# EasyEDA Pro project ProPrj_Simon_memory_game by SAAD_2026-03-01.epro

# Schematic Schematic1
Board Name: Board1; Create Date: 2026-02-08; Page Name: P1; Project Name: Simon_memory_game by SAAD; Schematic Name: Schematic1; Update Date: 2026-02-21; Company: EasyEDA.com; Page Size: A4; Version: V1.0
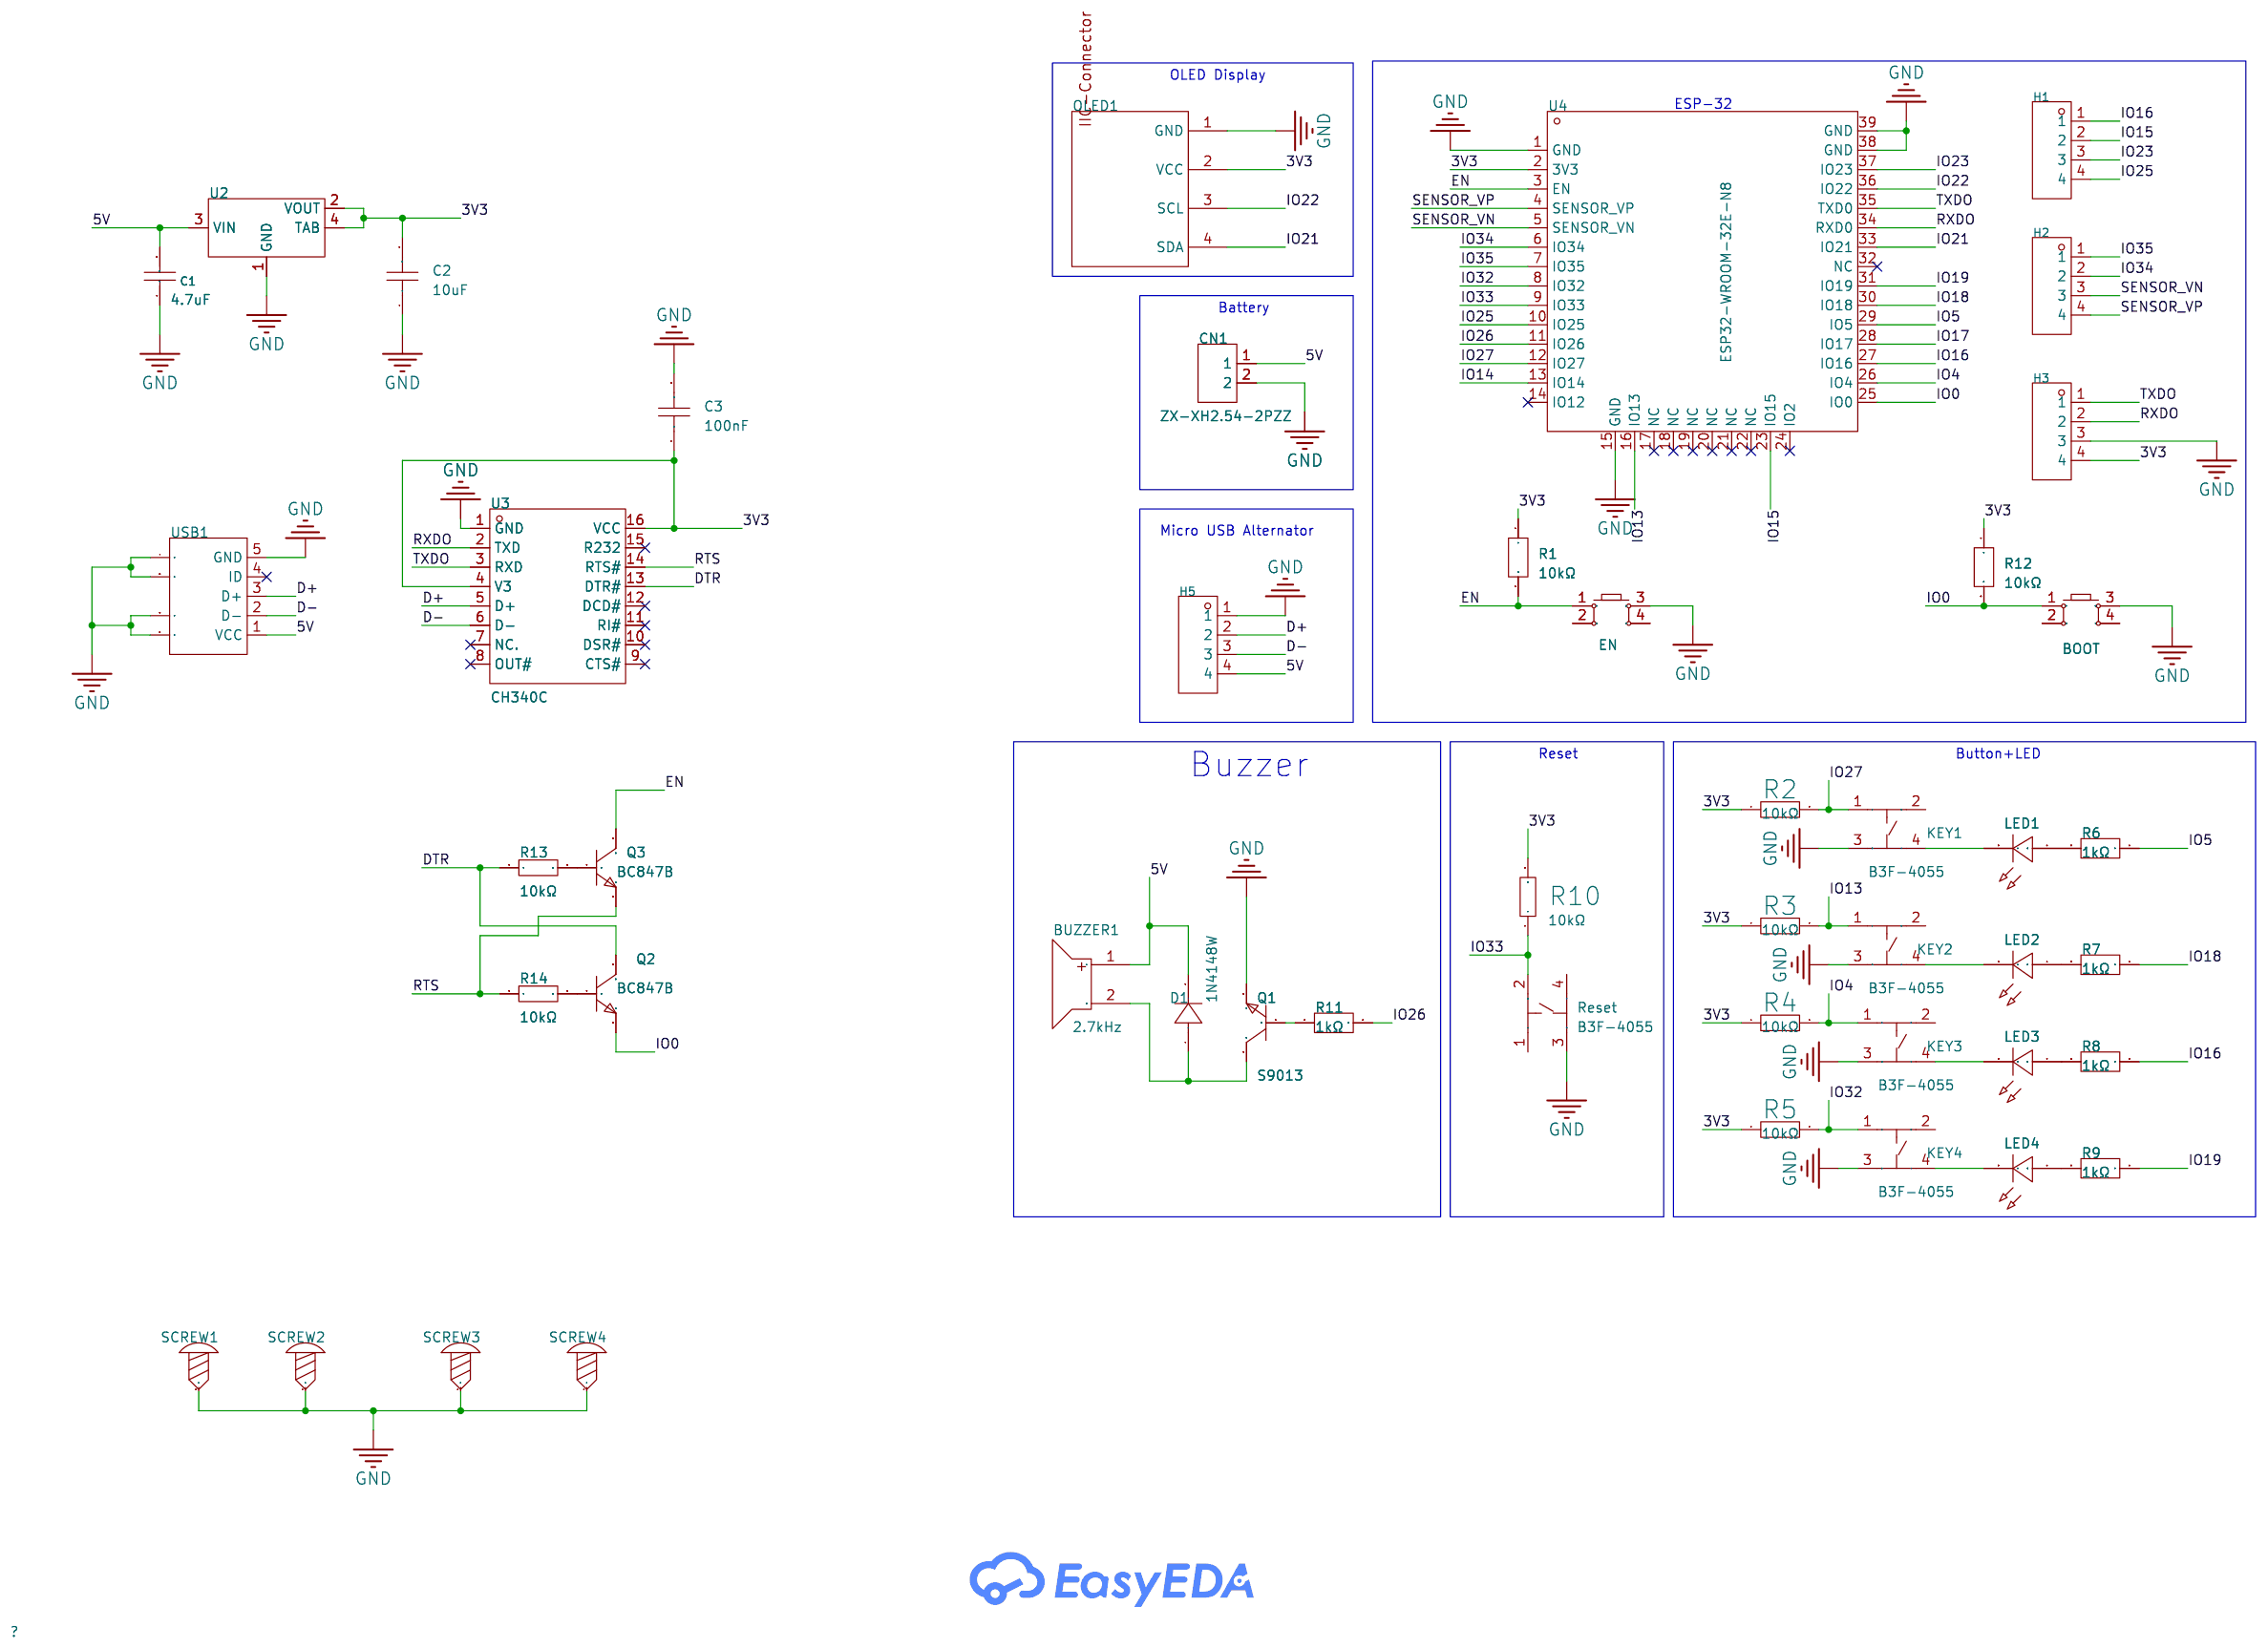
[diagram p0: schematic sheet]

## Parts
BOOT  -  [SW-SMD_4P-L6.0-W6.0-P4.50-LS9.0-2]
BUZZER1  2.7kHz  [BUZ-TH_BD9.0-P4.00-D0.6-FD]
C1  4.7uF  [C0603]
C2  10uF  [C0603]
C3  100nF  [C0603]
CN1  ZX-XH2.54-2PZZ  [CONN-TH_2P-P2.50_HX25003-2A]
D1  1N4148W  [SOD-123_L2.7-W1.6-LS3.7-FD]
EN  -  [SW-SMD_4P-L6.0-W6.0-P4.50-LS9.0-2]
H1  PZ254V-11-04P  [HDR-TH_4P-P2.54-V-M]
H2  PZ254V-11-04P  [HDR-TH_4P-P2.54-V-M]
H3  PZ254V-11-04P  [HDR-TH_4P-P2.54-V-M]
H5  PZ254V-11-04P  [HDR-TH_4P-P2.54-V-M]
KEY1  B3F-4055  [KEY-TH_4P-L12.0-W12.0-P5.00-LS13.4-EH]
KEY2  B3F-4055  [KEY-TH_4P-L12.0-W12.0-P5.00-LS13.4-EH]
KEY3  B3F-4055  [KEY-TH_4P-L12.0-W12.0-P5.00-LS13.4-EH]
KEY4  B3F-4055  [KEY-TH_4P-L12.0-W12.0-P5.00-LS13.4-EH]
LED1  -  [LED-TH_BD5.8-P2.54-FD]
LED2  -  [LED-TH_BD5.8-P2.54-FD]
LED3  -  [LED-TH_BD5.8-P2.54-FD]
LED4  -  [LED-TH_BD5.8-P2.54-FD]
OLED1  0.96OLED_4P_MODULE_JX  [0.96OLED_4P]
Q1  S9013  [SOT-23-3_L2.9-W1.3-P1.90-LS2.4-BR]
Q2  BC847B  [SOT-23-3_L2.9-W1.3-P1.90-LS2.4-BR]
Q3  BC847B  [SOT-23-3_L2.9-W1.3-P1.90-LS2.4-BR]
R1  10kΩ  [R0603]
R2  10kΩ  [R0603]
R3  10kΩ  [R0603]
R4  10kΩ  [R0603]
R5  10kΩ  [R0603]
R6  1kΩ  [R0603]
R7  1kΩ  [R0603]
R8  1kΩ  [R0603]
R9  1kΩ  [R0603]
R10  10kΩ  [R0603]
R11  1kΩ  [R0603]
R12  10kΩ  [R0603]
R13  10kΩ  [R_AXIAL-0.4]
R14  10kΩ  [R_AXIAL-0.4]
Reset  B3F-4055  [KEY-TH_4P-L12.0-W12.0-P5.00-LS13.4-EH]
SCREW1  -  [Screw-Hole-M3]
SCREW2  -  [Screw-Hole-M3]
SCREW3  -  [Screw-Hole-M3]
SCREW4  -  [Screw-Hole-M3]
U2  -  [SOT-223_L6.7-W3.5-P2.30-BR]
U3  CH340C  [SOP-16_L10.0-W3.9-P1.27-LS6.0-BL]
U4  ESP32-WROOM-32E-N8  [WIFIM-SMD_ESP32-WROOM-32-N4]
USB1  -  [MINI-USB-SMD_MINI-5PTP]

## Library data of the parts
BOOT EN = Key_SMD_6x6x6.5: Supplier Footprint: SMD
BUZZER1 = QMB-09B-03: Driver Circuitry:Passive (Externally Driven) Technology:Electromagnetic Voltage - Supply:2V~5V Voltage - Supply:2V~5V Frequency:2.7kHz Sound Pressure Level(SPL):85dB Diameter(φD):9mm Height:5.7mm; LCSC Part Name: 无源蜂鸣器QMB-09B-03; Supplier Part: C96256; Manufacturer: 华能; Supplier Footprint: 插件,D=9mm; JLCPCB Part Class: Extended Part; Datasheet: https://item.szlcsc.com/datasheet/QMB-09B-03/97460.html; Supplier: LCSC; Driver Circuitry: Passive (Externally Driven); Technology: Electromagnetic; Voltage - Supply: 2V~5V; Sound Pressure Level(SPL): 85dB; Diameter(φD): 9mm; Height: 5.7mm
C1 = CL10A475KP8NNNC: Capacitance:4.7uF Tolerance:±10% Tolerance:±10% Voltage Rating:10V Temperature Coefficient:X5R; LCSC Part Name: 4.7uF ±10% 10V; Supplier Part: C1705; Manufacturer: SAMSUNG(三星); Supplier Footprint: 0603; JLCPCB Part Class: Extended Part; Datasheet: https://item.szlcsc.com/datasheet/CL10A475KP8NNNC/2057.html; Supplier: LCSC; Tolerance: ±10%; Voltage Rating: 10V; Temperature Coefficient: X5R
C2 = CL10A106KP8NNNC: Capacitance:10uF Tolerance:±10% Tolerance:±10% Voltage Rating:10V Temperature Coefficient:X5R; LCSC Part Name: 10uF ±10% 10V; Supplier Part: C19702; Manufacturer: SAMSUNG(三星); Supplier Footprint: 0603; JLCPCB Part Class: Basic Part; Datasheet: https://item.szlcsc.com/datasheet/CL10A106KP8NNNC/20411.html; Supplier: LCSC; Tolerance: ±10%; Voltage Rating: 10V; Temperature Coefficient: X5R
C3 = CC0603KRX7R9BB104: Capacitance:100nF Tolerance:±10% Tolerance:±10% Voltage Rating:50V Temperature Coefficient:X7R; LCSC Part Name: 100nF ±10% 50V; Supplier Part: C14663; Manufacturer: YAGEO(国巨); Supplier Footprint: 0603; JLCPCB Part Class: Basic Part; Datasheet: https://item.szlcsc.com/datasheet/CC0603KRX7R9BB104/15331.html; Supplier: LCSC; Tolerance: ±10%; Voltage Rating: 50V; Temperature Coefficient: X7R
CN1 = ZX-XH2.54-2PZZ: Pins Structure:1x2P Pitch:2.5mm Mounting Type:Through Hole Reference Series:XH Number of Pins:2P Number of Rows:1 Number of PINs Per Row:2 Row Spacing:- Current Rating:2A Contact Material:Brass Contact Plating:Tin Operating Temperature:-25℃~+85℃ Operating; LCSC Part Name: 1x2P 间距:2.5mm 直插 系列:XH; Supplier Part: C7429632; Manufacturer: Megastar(兆星); Supplier Footprint: 插件,P=2.5mm; JLCPCB Part Class: Extended Part; Datasheet: https://item.szlcsc.com/datasheet/ZX-XH2.54-2PZZ/8427549.html; Supplier: LCSC; Pins Structure: 1x2P; Pitch: 2.5mm; Mounting Type: Through Hole; Reference Series: XH; Number of Pins: 2P; Number of Rows: 1; Number of PINs Per Row: 2; Current Rating: 2A; Contact Material: Brass; Contact Plating: Tin; Operating Temperature: -25℃~+85℃; Voltage Rating: 250V; Plastic Material: PA66; Flame Retardant Rating: UL94V-0; Color: White; Z-Height of the Board: 7mm; X-Length of Bottom Edge on Board (Spacing Line): 7.5mm; Y-Width of Bottom Edge on Board: 5.9mm
D1 = 1N4148W_C5345962: Diode Configuration:Independent Voltage - Forward(Vf@If):1.25V@150mA Voltage - DC Reverse(Vr):100V Current - Rectified:150mA Pd - Power Dissipation:350mW Reverse Leakage Current (Ir):1uA@75V Reverse Recovery Time (trr):4ns Operating Junction Temperature R; Supplier Part: C5345962; Manufacturer: HXY MOSFET(华轩阳电子); Supplier Footprint: SOD-123; JLCPCB Part Class: Extended Part; Datasheet: https://item.szlcsc.com/datasheet/1N4148W/6125799.html; Supplier: LCSC; Diode Configuration: Independent; Voltage - Forward(Vf@If): 1.25V@150mA; Voltage - DC Reverse(Vr): 100V; Current - Rectified: 150mA; Pd - Power Dissipation: 350mW; Reverse Leakage Current (Ir): 1uA@75V; Reverse Recovery Time (trr): 4ns; Operating Junction Temperature Range: -55℃~+150℃; Non-Repetitive Peak Forward Surge Current: 2A
H1-H3 H5 = PZ254V-11-04P: Pin Structure:1x4P Pitch:2.54mm Row Spacing:- Circluar Pins/Square Pins:Pin Header Mounting Type:Through Hole Number of Rows:1 Number of Pins:4P Current Rating:3A Voltage Rating (Max):250V Length of Mating Pin:6mm Insulation Height:2.5mm Length of End Con; LCSC Part Name: 1x4P 间距:2.54mm 方针 直插; Supplier Part: C2691448; Manufacturer: XFCN(兴飞); Supplier Footprint: 插件,P=2.54mm; JLCPCB Part Class: Extended Part; Datasheet: https://item.szlcsc.com/datasheet/PZ254V-11-04P/2801085.html; Supplier: LCSC; Pin Structure: 1x4P; Pitch: 2.54mm; Circluar Pins/Square Pins: Pin Header; Mounting Type: Through Hole; Number of Rows: 1; Number of Pins: 4P; Current Rating: 3A; Voltage Rating (Max): 250V; Length of Mating Pin: 6mm; Insulation Height: 2.5mm; Length of End Connection Pin: 3mm; Operating Temperature: -40℃~+105℃; Color: Black
KEY1-KEY4 Reset = B3F-4055_C84931: Circuit:SPST Actuator Style:Rectangular Button Mounting Type:Through Hole Length:12mm Width:12mm Switch Height:7.3mm Contact Current:50mA Voltage Rating:24V With Lamp:- Life:-; LCSC Part Name: 12*12*7.3mm 直插 轻触开关; Supplier Part: C84931; Manufacturer: OMRON(欧姆龙); Supplier Footprint: 插件; JLCPCB Part Class: Extended Part; Datasheet: https://item.szlcsc.com/datasheet/B3F-4055/86103.html; Supplier: LCSC; Circuit: SPST; Actuator Style: Rectangular Button; Mounting Type: Through Hole; Length: 12mm; Width: 12mm; Switch Height: 7.3mm; Contact Current: 50mA; Voltage Rating: 24V
LED1-LED4 = LED_TH-R_5mm: Supplier Footprint: Through
OLED1 = 0.96OLED_4P_MODULE_JX: Supplier Part: C9900004566; Supplier Footprint: 插件; JLCPCB Part Class: Extended Part; Supplier: LCSC
Q1 = S9013_C5184425: type:NPN Current - Collector(Ic):500mA Collector - Emitter Voltage VCEO:25V Pd - Power Dissipation:300mW DC Current Gain:120@50mA,1V DC Current Gain:120@50mA,1V Transition frequency(fT):150MHz Current - Collector Cutoff:100nA Vce Saturation(VCE(sat)):600m; Supplier Part: C5184425; Manufacturer: HXY MOSFET(华轩阳电子); Supplier Footprint: SOT-23; JLCPCB Part Class: Extended Part; Datasheet: https://item.szlcsc.com/datasheet/S9013/5849861.html; Supplier: LCSC; type: NPN; Current - Collector(Ic): 500mA; Collector - Emitter Voltage VCEO: 25V; Pd - Power Dissipation: 300mW; DC Current Gain: 120@50mA,1V; Transition frequency(fT): 150MHz; Current - Collector Cutoff: 100nA; Vce Saturation(VCE(sat)): 600mV
Q2 Q3 = BC847B_C20069135: type:NPN Current - Collector(Ic):100mA Collector - Emitter Voltage VCEO:45V Pd - Power Dissipation:200mW DC Current Gain:200@2.0mA,5.0V DC Current Gain:200@2.0mA,5.0V Transition frequency(fT):100MHz Current - Collector Cutoff:100nA Vce Saturation(VCE(sat); LCSC Part Name: hFE:200-450，丝印:1F NPN 电流:100mA 电压:45V; Supplier Part: C20069135; Manufacturer: R+O(宏嘉诚); Supplier Footprint: SOT-23; JLCPCB Part Class: Extended Part; Datasheet: https://item.szlcsc.com/datasheet/BC847B/21397173.html; Supplier: LCSC; type: NPN; Current - Collector(Ic): 100mA; Collector - Emitter Voltage VCEO: 45V; Pd - Power Dissipation: 200mW; DC Current Gain: 200@2.0mA,5.0V; Transition frequency(fT): 100MHz; Current - Collector Cutoff: 100nA; Vce Saturation(VCE(sat)): 500mV; Operating Temperature: -55℃~+150℃; Emitter-Base Voltage(Vebo): 6V
R1 R6-R9 R11 R12 = FRC0603F1001TS: Type:Thick Film Resistor Resistance:1kΩ Tolerance:±1% Tolerance:±1% Power(Watts):100mW Voltage-Supply(Max):75V Temperature Coefficient:±100ppm/℃ Temperature Coefficient:±100ppm/℃ Operating Temperature:-55℃~+155℃ Operating Temperature:-55℃~+155℃; LCSC Part Name: 1kΩ ±1% 100mW 厚膜电阻; Supplier Part: C2907002; Manufacturer: FOJAN(富捷); Supplier Footprint: 0603; JLCPCB Part Class: Extended Part; Supplier: LCSC; Type: Thick Film Resistor; Tolerance: ±1%; Power(Watts): 100mW; Voltage-Supply(Max): 75V; Temperature Coefficient: ±100ppm/℃; Operating Temperature: -55℃~+155℃
R2-R5 R10 = 0603WAF1002T5E: Type:Thick Film Resistor Resistance:10kΩ Tolerance:±1% Tolerance:±1% Power(Watts):100mW Voltage-Supply(Max):75V Temperature Coefficient:±100ppm/℃ Temperature Coefficient:±100ppm/℃ Operating Temperature:-55℃~+155℃ Operating Temperature:-55℃~+155℃; LCSC Part Name: 厚膜电阻 10kΩ ±1% 100mW; Supplier Part: C25804; Manufacturer: UNI-ROYAL(厚声); Supplier Footprint: 0603; JLCPCB Part Class: Basic Part; Datasheet: https://item.szlcsc.com/datasheet/0603WAF1002T5E/26547.html; Supplier: LCSC; Type: Thick Film Resistor; Tolerance: ±1%; Power(Watts): 100mW; Voltage-Supply(Max): 75V; Temperature Coefficient: ±100ppm/℃; Operating Temperature: -55℃~+155℃
R13 R14 = Res_AXIAL-1/4W: Supplier Footprint: Through
SCREW1-SCREW4 = Screw-Hole-M3: Supplier Footprint: 插件
U2 = AMS1117_1.2V: Supplier Footprint: SOT-223
U3 = CH340C: Applications Function:Transceiver USB Protocol:USB 2.0 Voltage - Supply:3.3V；5V Voltage - Supply:3.3V；5V Data Rate:2Mbps Operating Temperature:-20℃~+70℃ Operating Temperature:-20℃~+70℃ Current - Supply:7mA Supply Current (Iq):50uA; LCSC Part Name: USB转串口芯片; Supplier Part: C84681; Manufacturer: WCH(南京沁恒); Supplier Footprint: SOP-16; JLCPCB Part Class: Extended Part; Datasheet: https://item.szlcsc.com/datasheet/CH340C/85852.html; Supplier: LCSC; Applications Function: Transceiver; USB Protocol: USB 2.0; Voltage - Supply: 3.3V；5V; Data Rate: 2Mbps; Operating Temperature: -20℃~+70℃; Current - Supply: 7mA; Supply Current (Iq): 50uA
U4 = ESP32-WROOM-32E-N8: Supplier: LCSC; Supplier Part: C2973651; Manufacturer: null; Manufacturer Part: ESP32-WROOM-32E-N8-被合并; JLCPCB Part Class: Extended Part
USB1 = USB_MINI-B: Supplier Footprint: SMD

## Nets
3V3: C2.2 C3.1 H3.4 OLED1.2(VCC) R1.1 R2.1 R3.1 R4.1 R5.1 R10.2 R12.1 U2.2(VOUT) U2.4(TAB) U3.4(V3) U3.16(VCC) U4.2(3V3)
5V: BUZZER1.1 C1.2 CN1.1 D1.2(-) H5.4 U2.3(VIN) USB1.1(VCC)
GND: BOOT.3 C1.1 C2.1 C3.2 CN1.2 EN.3 H3.3 H5.1 KEY1.3 KEY2.3 KEY3.3 KEY4.3 OLED1.1(GND) Q1.2(E) Reset.3 SCREW1.1 SCREW2.1 SCREW3.1 SCREW4.1 U2.1(GND) U3.1(GND) U4.1(GND) U4.15(GND) U4.38(GND) U4.39(GND) USB1.5(GND) USB1.6(EH) USB1.7(EH) USB1.8(EH) USB1.9(EH)
D+: H5.2 U3.5(D+) USB1.3(D+)
D-: H5.3 U3.6(D-) USB1.2(D-)
DTR: Q2.3(C) R13.1 U3.13(DTR#)
EN: EN.1 Q3.3(C) R1.2 U4.3(EN)
IO0: BOOT.1 Q2.2(E) R12.2 U4.25(IO0)
IO4: KEY3.1 R4.2 U4.26(IO4)
IO5: R6.1 U4.29(IO5)
IO13: KEY2.1 R3.2 U4.16(IO13)
IO14: U4.13(IO14)
IO15: H1.2 U4.23(IO15)
IO16: H1.1 R8.1 U4.27(IO16)
IO17: U4.28(IO17)
IO18: R7.1 U4.30(IO18)
IO19: R9.1 U4.31(IO19)
IO21: OLED1.4(SDA) U4.33(IO21)
IO22: OLED1.3(SCL) U4.36(IO22)
IO23: H1.3 U4.37(IO23)
IO25: H1.4 U4.10(IO25)
IO26: R11.1 U4.11(IO26)
IO27: KEY1.1 R2.2 U4.12(IO27)
IO32: KEY4.1 R5.2 U4.8(IO32)
IO33: R10.1 Reset.2 U4.9(IO33)
IO34: H2.2 U4.6(IO34)
IO35: H2.1 U4.7(IO35)
RTS: Q3.2(E) R14.1 U3.14(RTS#)
RXDO: H3.2 U3.2(TXD) U4.34(RXD0)
SENSOR_VN: H2.3 U4.5(SENSOR_VN)
SENSOR_VP: H2.4 U4.4(SENSOR_VP)
TXDO: H3.1 U3.3(RXD) U4.35(TXD0)
$1N4177: LED1.1(C) R6.2
$1N4181: KEY1.4 LED1.2(A)
$1N4249: LED2.1(C) R7.2
$1N4314: LED3.1(C) R8.2
$1N4446: LED4.1(C) R9.2
$1N4453: KEY4.4 LED4.2(A)
$1N4457: KEY3.4 LED3.2(A)
$1N4462: KEY2.4 LED2.2(A)
$1N4873: Q1.1(B) R11.2
$1N4989: BUZZER1.2 D1.1(+) Q1.3(C)
$1N17958: Q3.1(B) R13.2
$1N17984: Q2.1(B) R14.2

Not connected (* = marked no-connect by the designer): BOOT 2 4; EN 2 4; KEY1 2; KEY2 2; KEY3 2; KEY4 2; Reset 1 4; U3 7(NC.)* 8(OUT#)* 9(CTS#)* 10(DSR#)* 11(RI#)* 12(DCD#)* 15(R232)*; U4 14(IO12)* 17(NC)* 18(NC)* 19(NC)* 20(NC)* 21(NC)* 22(NC)* 24(IO2)* 32(NC)*; USB1 4(ID)*

## Notes on the sheet
- OLED Display
- ESP-32
- Battery
- Micro USB Alternator
- Reset
- Button+LED
- Buzzer

# Board PCB1
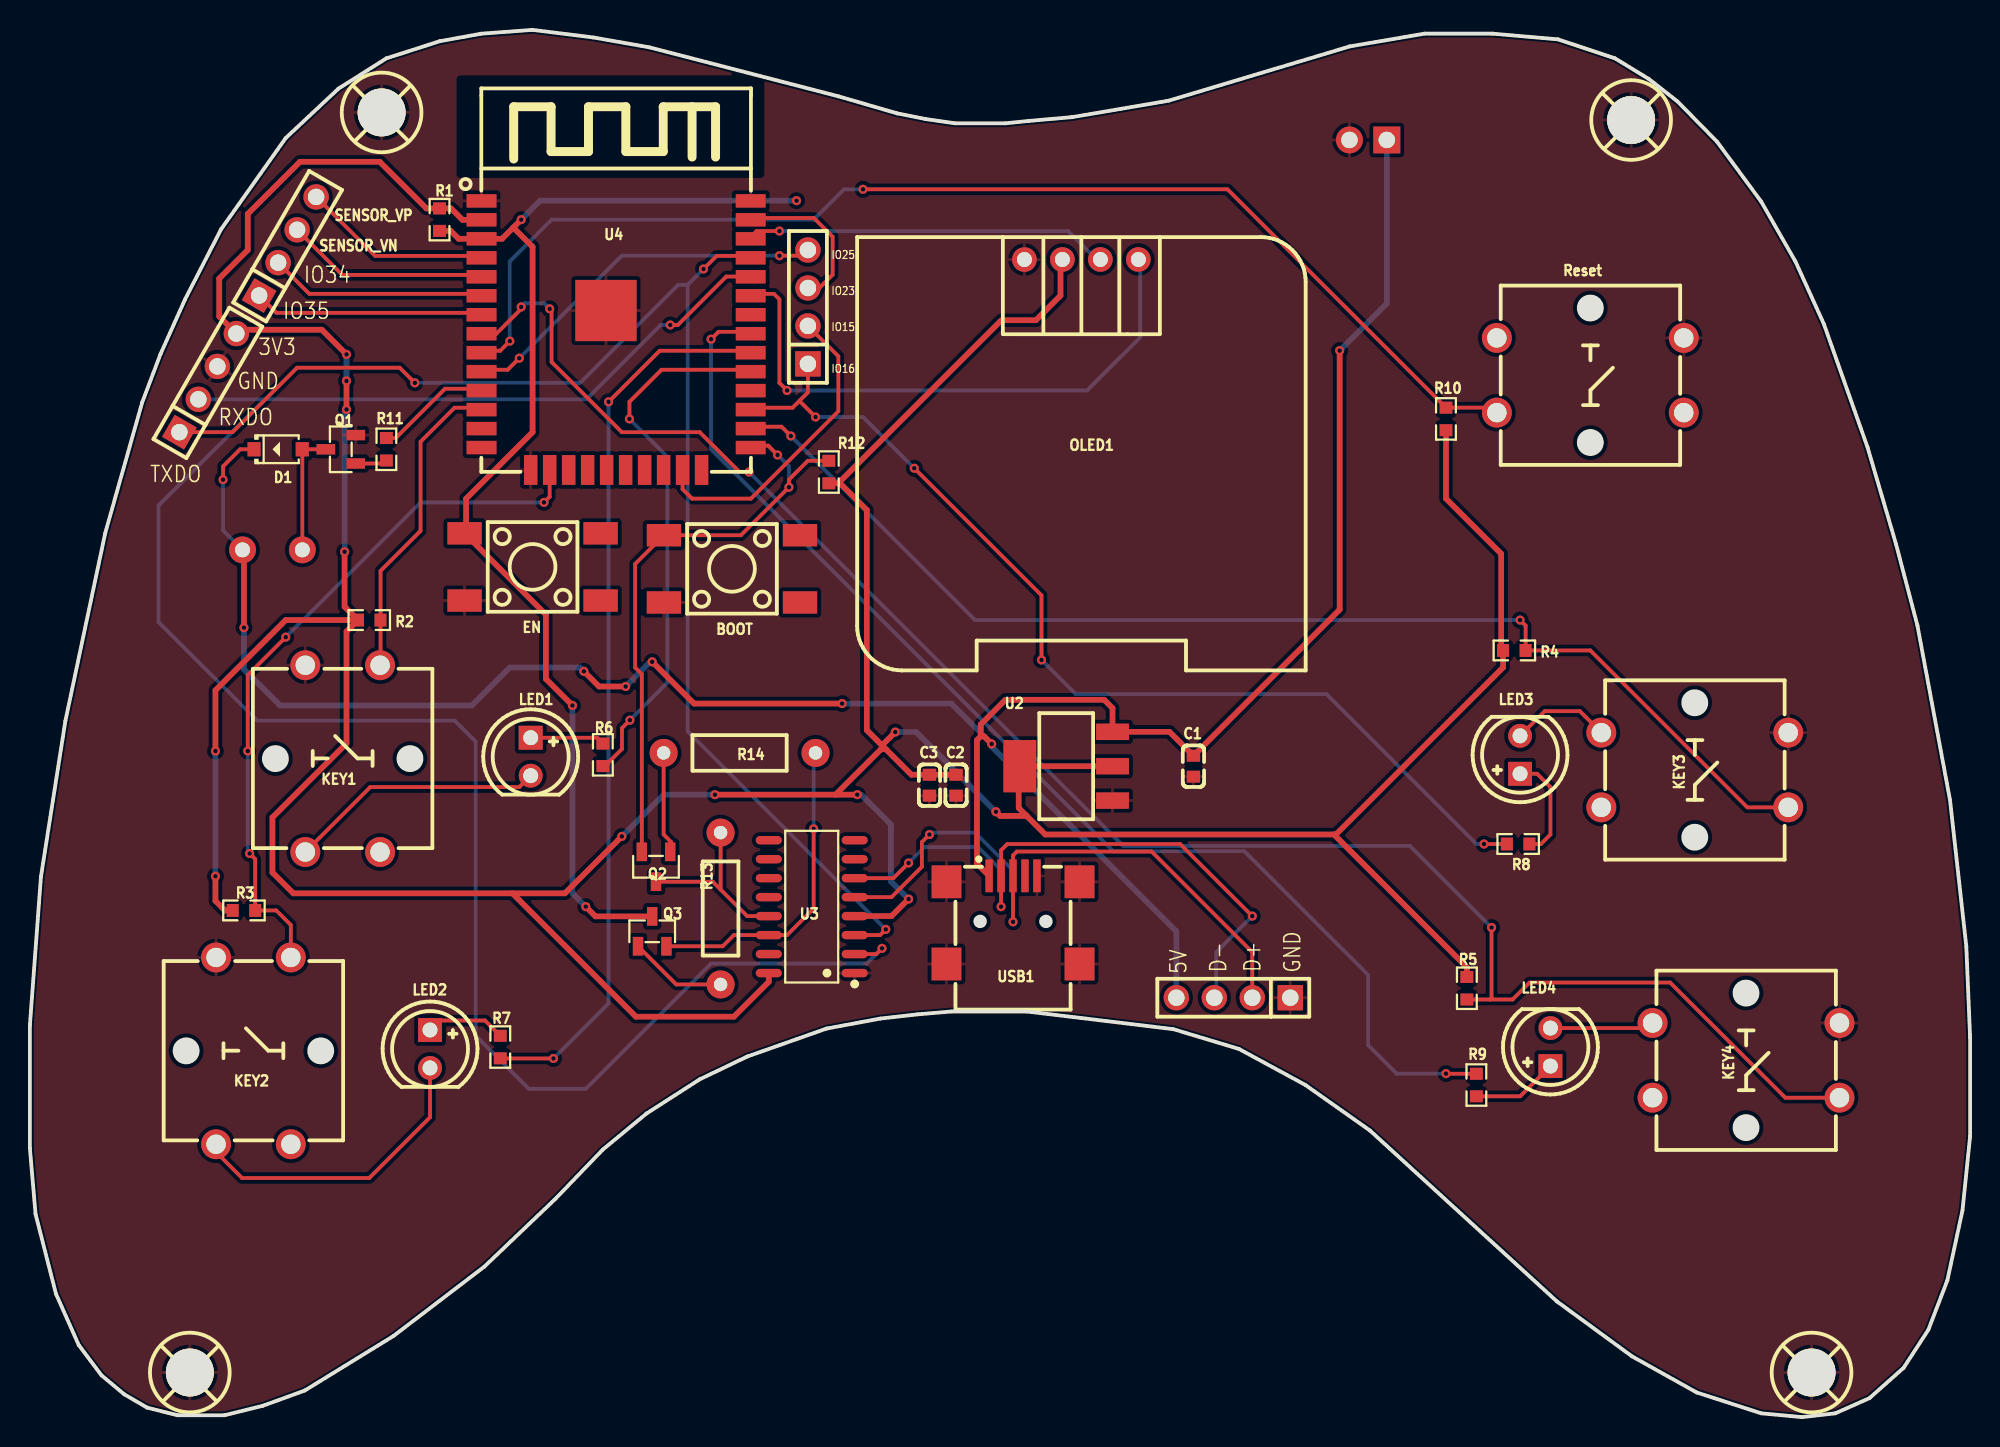
[diagram p1: board, top side]
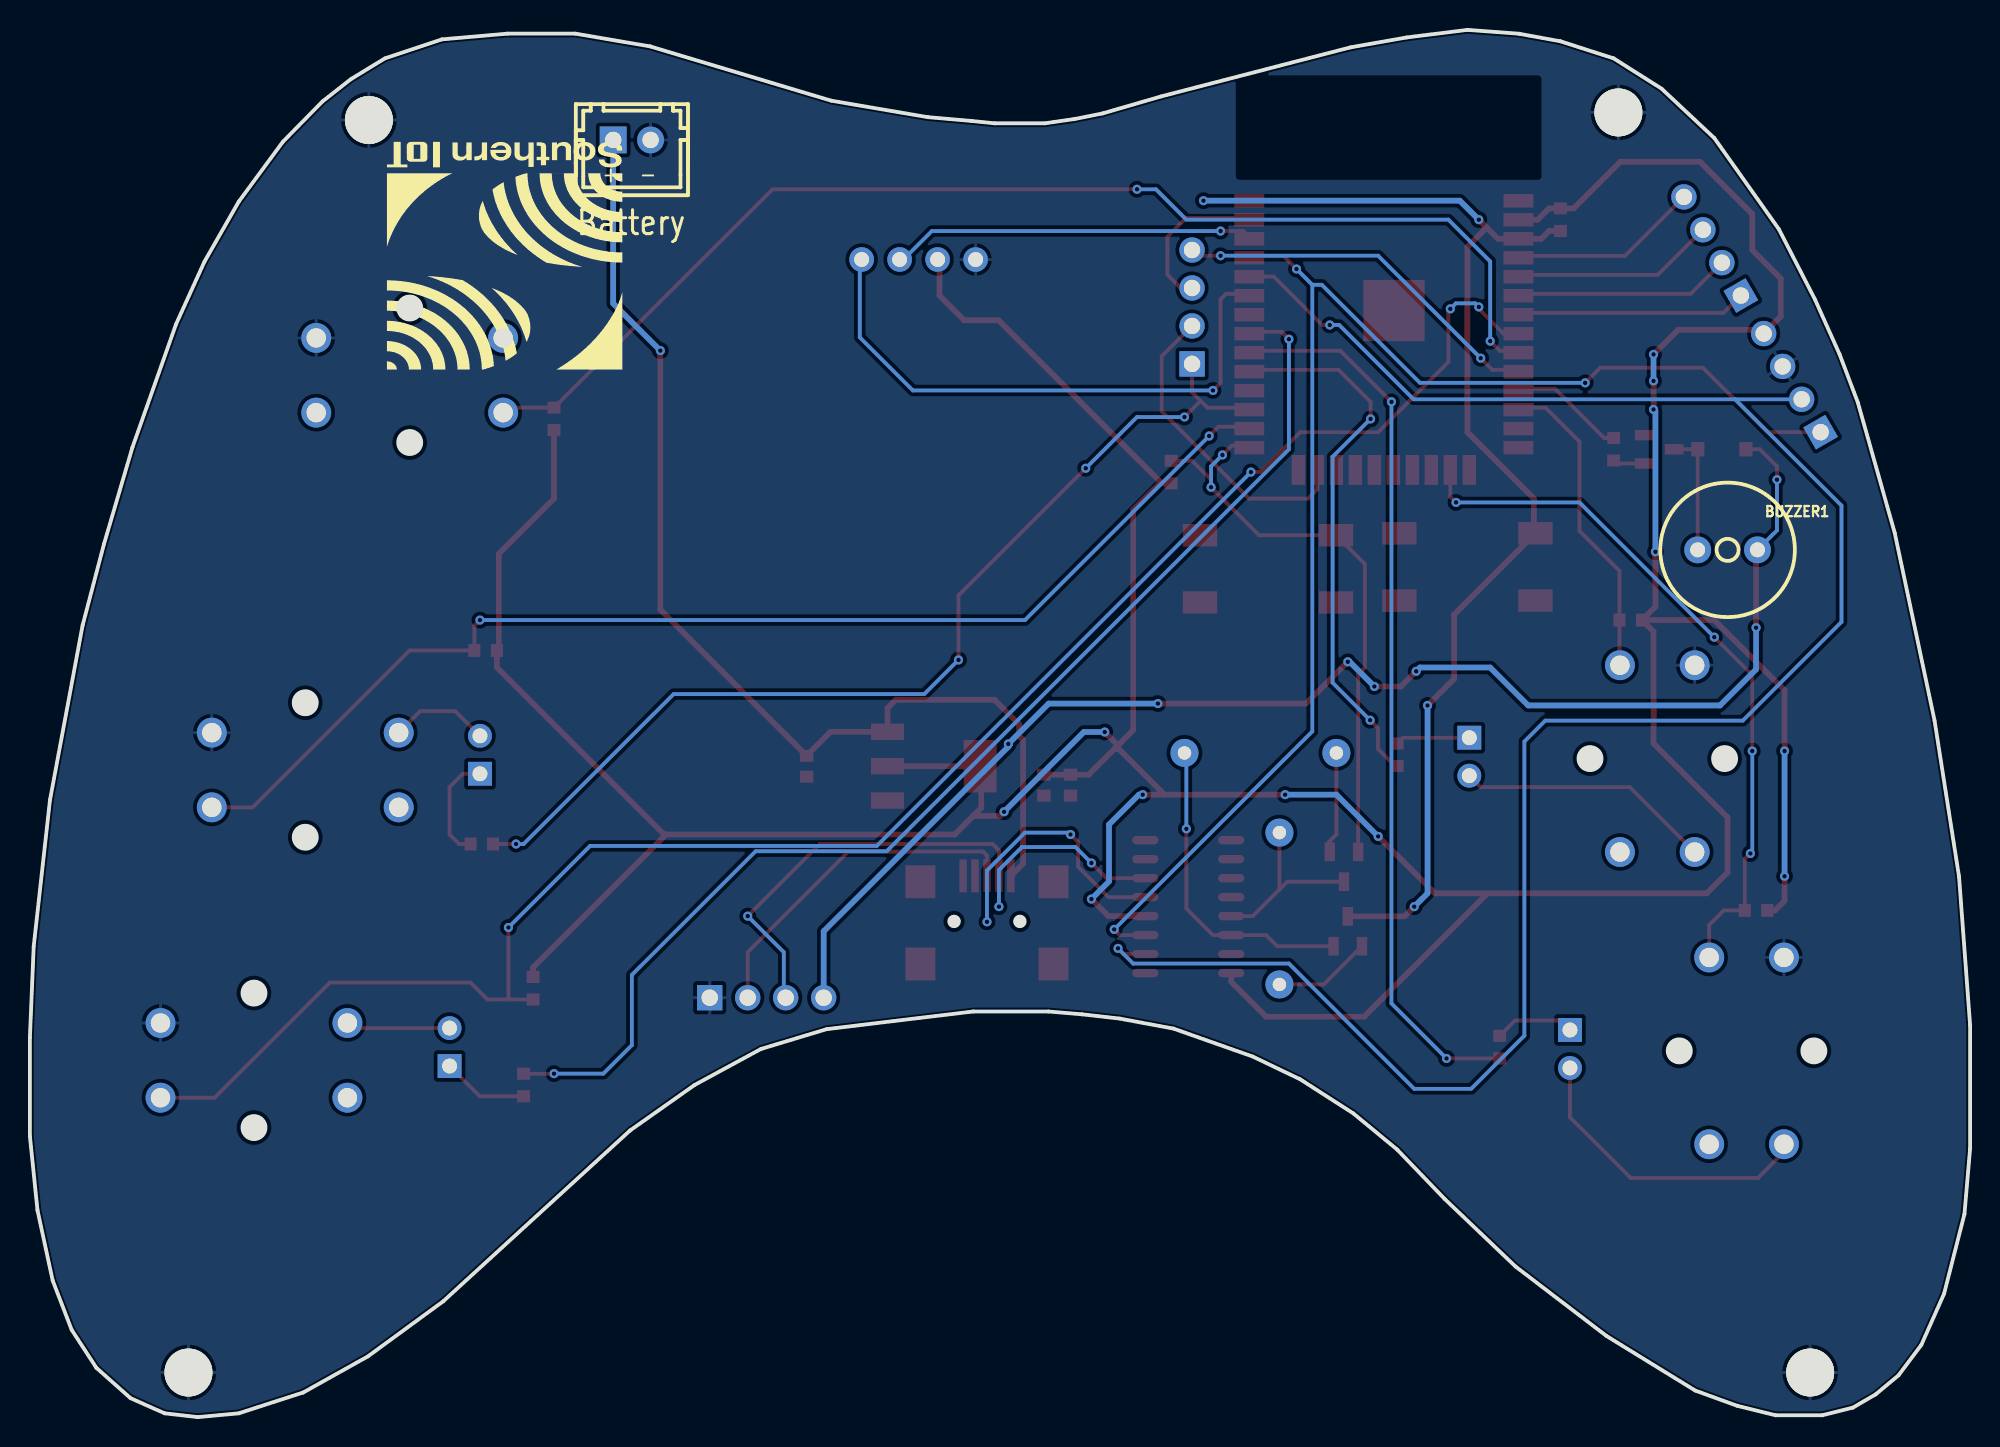
[diagram p2: board, bottom side, seen from below]

Outline 129.76 x 92.84 mm; copper layers: Top Layer, Bottom Layer. Coordinates in mm from the lower left corner of the outline.
Outline path: 0,26.24 0.74,36.16 2.38,46.61 5.04,59.18 7.51,67.9 8.73,71.12 10.38,74.8 12.79,79.5 17.11,85.6 20.64,88.91 23.84,90.93 27.4,92.08 30.19,92.58 33.62,92.84 37.68,92.33 41.42,91.67 54.07,88.39 58,87.25 59.91,86.87 61.88,86.58 65.24,86.58 66.77,86.74 69.69,87 76.16,88.1 88.28,91.73 93.28,92.59 97.8,92.59 102.2,92.2 106.01,90.93 108.29,89.54 110.18,88.05 112.83,85.35 115.79,81.34 118.07,77.34 119.98,73.15 122.9,64.9 124.8,58.42 126.23,52.98 128.42,41.29 129.5,31.5 129.76,25.4 129.76,18.8 129.25,13.84 128.23,9.14 126.96,5.84 125.31,3.3 123.03,1.27 120.74,0.25 118.53,0 115.79,0.25 111.47,1.65 107.15,4.06 102.12,7.74 89.63,19.18 85.31,22.22 80.86,24.64 76.47,25.96 66.66,27.15 61.65,27.15 59.37,26.95 56.86,26.67 53.27,26 47.97,24.13 44.79,22.61 41.24,20.32 38.32,17.91 35.14,14.61 30.4,10.08 24.32,5.43 18.38,1.78 15.58,0.76 13.02,0.13 9.87,0.13 7.84,0.64 6.31,1.52 4.79,2.79 3.27,4.83 1.74,8.25 0.38,13.59 0,17.97 0,26.24
Stack: Top Layer 0.035mm / Dielectric1 1.51mm FR4 er 4.5 / Bottom Layer 0.035mm

## Design rules (mm)
template: JLCPCB Capability(Two Layers Board)
spacing copperThickness1oz (default): track to track 0.102, other pairs 0.152 to 0.3
spacing copperThickness2oz: track to track 0.203, other pairs 0.152 to 0.3
track width copperThickness1oz (default): min 0.127, default 0.254, max 2.54
track width copperThickness2oz: min 0.203, default 0.254, max 2.54
differential pair differentialPair (default): width min 0.127, default 0.254, max 2.54; gap min 0.152, default 0.152
via viaSize (default): diameter min 0.5, default 0.61, max 10; hole min 0.3, default 0.305, max 6.3

## Placement (name value [footprint] x y rotation side)
BOOT  -  [SW-SMD_4P-L6.0-W6.0-P4.50-LS9.0-2]  46.95 56.77 0 top
BUZZER1  2.7kHz  [BUZ-TH_BD9.0-P4.00-D0.6-FD]  16.22 58.04 0 bottom
C1  4.7uF  [C0603]  77.81 43.56 90 top
C2  10uF  [C0603]  61.94 42.29 90 top
C3  100nF  [C0603]  60.16 42.29 270 top
CN1  ZX-XH2.54-2PZZ  [CONN-TH_2P-P2.50_HX25003-2A]  89.5 85.47 180 bottom
D1  1N4148W  [SOD-123_L2.7-W1.6-LS3.7-FD]  16.6 64.77 180 top
EN  -  [SW-SMD_4P-L6.0-W6.0-P4.50-LS9.0-2]  33.62 56.9 0 top
H1  PZ254V-11-04P  [HDR-TH_4P-P2.54-V-M]  52.03 74.3 90 top
H2  PZ254V-11-04P  [HDR-TH_4P-P2.54-V-M]  17.24 78.36 60 top
H3  PZ254V-11-04P  [HDR-TH_4P-P2.54-V-M]  11.9 69.22 60 top
H5  PZ254V-11-04P  [HDR-TH_4P-P2.54-V-M]  80.48 28.07 180 top
KEY1  B3F-4055  [KEY-TH_4P-L12.0-W12.0-P5.00-LS13.4-EH]  20.92 44.07 90 top
KEY2  B3F-4055  [KEY-TH_4P-L12.0-W12.0-P5.00-LS13.4-EH]  14.95 24.51 90 top
KEY3  B3F-4055  [KEY-TH_4P-L12.0-W12.0-P5.00-LS13.4-EH]  111.34 43.31 0 top
KEY4  B3F-4055  [KEY-TH_4P-L12.0-W12.0-P5.00-LS13.4-EH]  114.77 23.88 0 top
LED1  -  [LED-TH_BD5.8-P2.54-FD]  33.49 44.2 270 top
LED2  -  [LED-TH_BD5.8-P2.54-FD]  26.76 24.64 270 top
LED3  -  [LED-TH_BD5.8-P2.54-FD]  99.66 44.32 90 top
LED4  -  [LED-TH_BD5.8-P2.54-FD]  101.69 24.77 90 top
OLED1  0.96OLED_4P_MODULE_JX  [0.96OLED_4P]  70.32 77.47 0 top
Q1  S9013  [SOT-23-3_L2.9-W1.3-P1.90-LS2.4-BR]  20.79 64.77 0 top
Q2  BC847B  [SOT-23-3_L2.9-W1.3-P1.90-LS2.4-BR]  41.87 36.83 90 top
Q3  BC847B  [SOT-23-3_L2.9-W1.3-P1.90-LS2.4-BR]  41.62 32.51 270 top
R1  10kΩ  [R0603]  27.4 80.14 270 top
R2  10kΩ  [R0603]  22.7 53.34 0 top
R3  10kΩ  [R0603]  14.31 33.91 0 top
R4  10kΩ  [R0603]  99.28 51.31 0 top
R5  10kΩ  [R0603]  96.1 28.7 270 top
R6  1kΩ  [R0603]  38.32 44.32 90 top
R7  1kΩ  [R0603]  31.46 24.77 90 top
R8  1kΩ  [R0603]  99.53 38.35 0 top
R9  1kΩ  [R0603]  96.74 22.22 270 top
R10  10kΩ  [R0603]  94.71 66.8 270 top
R11  1kΩ  [R0603]  23.84 64.77 270 top
R12  10kΩ  [R0603]  53.43 63.25 90 top
R13  10kΩ  [R_AXIAL-0.4]  46.19 34.04 270 top
R14  10kΩ  [R_AXIAL-0.4]  47.46 44.45 180 top
Reset  B3F-4055  [KEY-TH_4P-L12.0-W12.0-P5.00-LS13.4-EH]  104.36 69.72 0 top
SCREW1  -  [Screw-Hole-M3]  10.76 2.92 0 top
SCREW2  -  [Screw-Hole-M3]  23.59 87.25 0 top
SCREW3  -  [Screw-Hole-M3]  107.15 86.74 0 top
SCREW4  -  [Screw-Hole-M3]  119.22 2.92 0 top
U2  -  [SOT-223_L6.7-W3.5-P2.30-BR]  69.31 43.56 0 top
U3  CH340C  [SOP-16_L10.0-W3.9-P1.27-LS6.0-BL]  52.29 34.16 90 top
U4  ESP32-WROOM-32E-N8  [WIFIM-SMD_ESP32-WROOM-32-N4]  39.21 72.39 0 top
USB1  -  [MINI-USB-SMD_MINI-5PTP]  65.75 33.27 0 top

## Footprints (pads in the part's own frame, mm; a bottom-side part is the same pattern mirrored in y, then rotated)
0.96OLED_4P
  round 1.65 hole 1: 1(-3.81,-0.002) 2(-1.27,0.002) 3(1.27,0.002) 4(3.81,0.002)
BUZ-TH_BD9.0-P4.00-D0.6-FD
  round 1.8 hole 1: 1(-2,0) 2(2,0)
C0603
  rect 0.8x0.9 smd: 1(-0.7,0) 2(0.7,0)
CONN-TH_2P-P2.50_HX25003-2A
  rect 1.8x1.8 hole 1.1: 1(-1.25,0)
  round 1.8 hole 1.1: 2(1.25,0)
HDR-TH_4P-P2.54-V-M
  rect 1.7x1.7 hole 1.1: 1(-3.81,0)
  round 1.7 hole 1.1: 2(-1.27,0) 3(1.27,0) 4(3.81,0)
KEY-TH_4P-L12.0-W12.0-P5.00-LS13.4-EH
  round 2 hole 1.3: 1(6.25,-2.5) 2(-6.25,-2.5) 3(6.25,2.5) 4(-6.25,2.5)
LED-TH_BD5.8-P2.54-FD
  rect 1.6x1.6 hole 1: 1(-1.27,0)
  round 1.6 hole 1: 2(1.27,0)
MINI-USB-SMD_MINI-5PTP
  rect 0.5x2.2 smd: 1(-1.6,2.95) 2(-0.8,2.95) 3(0,2.95) 4(0.8,2.95) 5(1.6,2.95)
  rect 2x2.2 smd: 6(-4.45,2.55) 7(4.45,2.55) 8(4.45,-2.95) 9(-4.45,-2.95)
R0603
  rect 0.806x0.864 smd: 1(-0.753,0) 2(0.753,0)
R_AXIAL-0.4
  round 1.879 hole 0.899: 1(-5.08,0) 2(5.08,0)
Screw-Hole-M3
  round 3.2 hole 3.2: 1(-0.064,0.064)
SOD-123_L2.7-W1.6-LS3.7-FD
  rect 0.88x0.96 smd: 1(-1.61,0) 2(1.61,0)
SOP-16_L10.0-W3.9-P1.27-LS6.0-BL
  oval 0.56x1.745 smd: 1(-4.445,-2.873) 2(-3.175,-2.873) 3(-1.905,-2.873) 4(-0.635,-2.873) 5(0.635,-2.873) 6(1.905,-2.873) 7(3.175,-2.873) 8(4.445,-2.873) 9(4.445,2.873) 10(3.175,2.873) 11(1.905,2.873) 12(0.635,2.873) 13(-0.635,2.873) 14(-1.905,2.873) 15(-3.175,2.873) 16(-4.445,2.873)
SOT-23-3_L2.9-W1.3-P1.90-LS2.4-BR
  rect 1.25x0.7 smd: 1(1,-0.95) 2(1,0.95) 3(-1,0)
SOT-223_L6.7-W3.5-P2.30-BR
  rect 2.2x1.1 smd: 1(3.099,-2.3) 2(3.099,0) 3(3.099,2.3)
  rect 2.2x3.5 smd: 4(-3.099,0)
SW-SMD_4P-L6.0-W6.0-P4.50-LS9.0-2
  rect 2.3x1.5 smd: 1(-4.55,2.25) 2(4.55,2.25) 3(-4.55,-2.25) 4(4.55,-2.25)
WIFIM-SMD_ESP32-WROOM-32-N4
  rect 2x0.9 smd: 1(-9,9.005) 2(-9,7.735) 3(-9,6.465) 4(-9,5.195) 5(-9,3.925) 6(-9,2.655) 7(-9,1.385) 8(-9,0.115) 9(-9,-1.155) 10(-9,-2.425) 11(-9,-3.695) 12(-9,-4.965) 13(-9,-6.235) 14(-9,-7.505) 25(9,-7.505) 26(9,-6.235) 27(9,-4.965) 28(9,-3.695) 29(9,-2.425) 30(9,-1.155) 31(9,0.115) 32(9,1.385) 33(9,2.655) 34(9,3.925) 35(9,5.195) 36(9,6.465) 37(9,7.735) 38(9,9.005)
  rect 0.9x2 smd: 15(-5.715,-9.005) 16(-4.445,-9.005) 17(-3.175,-9.005) 18(-1.905,-9.005) 19(-0.635,-9.005) 20(0.635,-9.005) 21(1.905,-9.005) 22(3.175,-9.005) 23(4.445,-9.005) 24(5.715,-9.005)
  rect 4.1x4.1 smd: 39(-0.68,1.665)

## Nets
As in the schematic.

Pads without a net: BOOT 2 4; EN 2 4; KEY1 2; KEY2 2; KEY3 2; KEY4 2; Reset 1 4; U3 7 8 9 10 11 12 15; U4 14 17 18 19 20 21 22 24 32; USB1 4

## Via types
v1: diameter 0.61, hole 0.305, Top Layer to Bottom Layer, 63 vias

## Routing (per net, layer and track width the routed paths; a pad name or vN(x,y) marks a point on that pad's centre or on a via; arc(x,y) is an arc through that point)
3V3: length 319.6
  Top Layer w0.381: v1(12.41,44.58) 12.41,48.64 17.11,53.34 R2.1 ; 56.89,45.06 55.97,45.97 55.97,60.71 54.18,62.49 ; 56.89,45.06 57.25,44.7 ; 56.89,45.06 57.09,45.06 v1(57.88,45.85) ; v1(39.59,38.86) 35.78,35.05 32.27,35.05 ; 54.18,62.49 54.18,62.62 64.91,73.35 ; 54.18,62.49 R12.1 ; 53.88,41.66 56.92,44.7 57.25,44.7 ; 53.88,41.66 v1(55.34,41.66) ; 53.88,41.66 v1(45.81,41.66) ; 32.27,35.05 17.62,35.05 16.22,36.45 16.22,40.13 21.17,45.09 21.17,52.57 R2.1 ; 32.27,35.05 40.53,26.8 47.08,26.8 49.41,29.13 U3.16 ; 57.25,44.7 58.95,42.99 C3.1 C2.2 ; 87.21,38.99 87.34,38.99 98.52,50.17 R4.1 98.4,51.44 98.4,57.78 94.71,61.47 R10.2 ; 87.21,38.99 96.1,30.1 R5.1 ; 87.21,38.99 67.91,38.99 66.66,40.23 ; v1(21.05,57.91) 21.05,54.24 R2.1 ; v1(21.17,69.34) v1(21.17,67.44) ; U2.2 U2.4 66.13,43.48 66.13,40.77 66.66,40.23 ; v1(64.61,40.51) 64.89,40.23 66.66,40.23 ; R3.1 13.04,33.91 12.41,34.54 v1(12.41,36.2) ; U4.2 28.93,80.12 28.17,80.89 R1.1 26.52,80.89 23.39,84.01 18.06,84.01 14.57,80.52 14.57,78.11 12.66,76.2 12.66,73.66 H3.4 14.06,72.77 19.52,72.77 v1(21.17,71.12) ; v1(58.76,34.67) 57.62,33.53 U3.4 ; 69.05,77.22 68.92,77.09 68.92,75.06 67.27,73.41 64.99,73.41
  Bottom Layer w0.381: v1(57.88,45.85) 59.27,45.85 v1(64.61,40.51) ; v1(55.34,41.66) 55.59,41.66 57.59,39.66 57.59,35.85 v1(58.76,34.67) ; v1(12.41,44.58) v1(12.41,36.2) ; v1(21.17,71.12) v1(21.17,69.34) ; v1(21.17,67.44) 21.05,67.31 v1(21.05,57.91) ; v1(39.59,38.86) 42.38,41.66 v1(45.81,41.66)
5V: length 169.8
  Top Layer w0.254: D1.2 14.06,64.77 12.92,63.63 v1(12.92,62.74)
  Top Layer w0.381: 64.15,36.22 63.34,37.04 63.34,45.31 63.59,45.56 ; BUZZER1.1 14.31,57.94 v1(14.31,52.83) ; v1(87.59,71.37) 87.59,54.04 C1.2 76.21,45.86 U2.3 72.4,47.45 71.85,48.01 65.24,48.01 63.59,46.36 63.59,45.56 ; 63.59,45.56 63.81,45.56 v1(64.32,45.05) ; v1(39.84,48.9) 38.06,48.9 v1(37.05,49.91) ; v1(41.62,50.55) 44.41,47.75 v1(54.32,47.75)
  Bottom Layer w0.254: v1(12.92,62.74) 12.92,59.34 BUZZER1.1
  Bottom Layer w0.381: v1(87.59,71.37) 90.75,74.53 CN1.1 ; v1(39.84,48.9) 41.49,50.55 v1(41.62,50.55) ; v1(37.05,49.91) 36.79,50.17 32.09,50.17 29.55,47.62 16.73,47.62 14.31,50.04 v1(14.31,52.83) ; H5.4 76.67,32.51 64.32,44.86 v1(64.32,45.05) 61.62,47.75 v1(54.32,47.75)
D+: length 44.2
  Top Layer w0.254: v1(60.16,38.99) 59.65,38.48 59.65,36.83 57.62,34.8 U3.5 ; v1(65.75,33.15) USB1.3 65.75,37.59 66,37.85 75.02,37.85 81.75,31.12 H5.2
  Bottom Layer w0.254: v1(65.75,33.15) 65.75,36.58 63.21,39.12 60.29,39.12 v1(60.16,38.99)
D-: length 43
  Top Layer w0.254: v1(81.75,33.53) 76.93,38.35 65.37,38.35 64.95,37.94 USB1.2 v1(64.95,34.16) ; v1(58.76,37.08) 57.75,36.07 U3.6
  Bottom Layer w0.254: H5.3 79.34,28.19 79.34,31.12 v1(81.75,33.53) ; v1(64.95,34.16) 64.95,36.61 63.41,38.15 59.83,38.15 v1(58.76,37.08)
DTR: length 12.3
  Top Layer w0.254: 46.19,35.31 45.67,35.83 Q2.3 ; 46.19,35.31 47.97,33.53 U3.13 ; 46.19,35.31 R13.1
EN: length 81.1
  Top Layer w0.381: 32.33,79.61 33.62,78.32 33.62,65.91 29.17,61.47 29.17,59.25 EN.1 34.51,53.71 34.51,49.4 v1(36.29,47.62) ; 32.33,79.61 31.57,78.86 U4.3 28.68,78.86 28.15,79.38 R1.2 ; 32.33,79.61 v1(32.86,80.14) ; Q3.3 37.83,33.51 v1(37.17,34.16)
  Bottom Layer w0.381: v1(32.86,80.14) 34.13,81.41 v1(51.27,81.41) ; v1(36.29,47.62) 36.29,35.05 v1(37.17,34.16)
IO0: length 40.1
  Top Layer w0.254: R12.2 52.03,64 50.76,62.74 v1(50.76,62.23) 47.55,59.02 BOOT.1 40.48,57.09 40.48,50.17 40.92,49.72 40.92,37.83 ; 48.21,65.01 49.38,65.01 v1(50,64.39)
  Bottom Layer w0.254: v1(50.76,62.23) 50.76,63.63 v1(50,64.39)
IO4: length 80.9
  Top Layer w0.254: v1(50.89,65.66) 50.27,66.28 48.21,66.28 ; v1(99.66,53.34) 100.03,52.97 R4.2 104.36,51.31 114.86,40.81 KEY3.1
  Bottom Layer w0.254: v1(50.89,65.66) 63.21,53.34 v1(99.66,53.34)
IO5: length 36.3
  Top Layer w0.254: 48.21,70.09 42.24,70.09 40.1,67.95 v1(40.1,66.8) ; v1(40.13,46.64) 39.6,46.11 39.6,44.71 38.45,43.57 R6.1
  Bottom Layer w0.254: v1(40.13,46.64) 42.64,49.15 42.64,64.26 v1(40.1,66.8)
IO13: length 48
  Top Layer w0.254: 34.76,63.51 34.76,61.6 v1(34.38,61.21) ; v1(17.11,52.2) 14.57,49.66 v1(14.57,44.58) ; v1(14.7,37.72) 15.07,37.35 R3.2 16.47,33.91 17.45,32.93 KEY2.1
  Bottom Layer w0.254: v1(17.11,52.2) 26.13,61.21 v1(34.38,61.21) ; v1(14.7,37.72) 14.57,37.85 v1(14.57,44.58)
IO15: length 21.1
  Top Layer w0.254: H1.2 54.07,70.99 54.07,67.31 48.22,61.47 44.29,61.47 43.65,62.1 43.65,63.51
IO16: length 68.3
  Top Layer w0.254: H1.1 52.03,68.58 51.49,68.03 ; v1(67.65,50.67) 67.65,54.99 v1(59.15,63.5) ; v1(97.25,38.35) R8.1 ; 51.49,68.03 51.01,67.55 48.21,67.55 ; 51.49,68.03 51.49,67.98 v1(52.54,66.93)
  Bottom Layer w0.254: v1(52.54,66.93) 55.72,66.93 v1(59.15,63.5) ; v1(97.25,38.35) 96.74,38.35 86.7,48.39 69.94,48.39 v1(67.65,50.67)
IO18: length 60
  Top Layer w0.254: 48.21,71.36 42.12,71.36 v1(38.7,67.95) ; v1(35.02,24) 31.47,24 R7.1
  Bottom Layer w0.254: v1(38.7,67.95) 38.7,27.69 v1(35.02,24)
IO19: length 81.5
  Top Layer w0.254: 48.21,72.63 46.05,72.63 v1(45.56,72.14) ; v1(94.71,22.99) 94.71,22.98 R9.1
  Bottom Layer w0.254: v1(94.71,22.99) 91.4,22.99 89.5,24.89 89.5,29.59 81.22,37.87 72.46,37.87 45.56,64.77 v1(45.56,72.14)
IO21: length 38.5
  Top Layer w0.254: 48.21,75.17 49.76,75.17 50.13,74.8 50.13,69.22 v1(50.64,68.71)
  Bottom Layer w0.254: 74.13,77.22 74.26,77.09 74.26,72.26 70.7,68.71 v1(50.64,68.71)
IO22: length 24.4
  Top Layer w0.254: v1(50.13,79.38) 48.6,79.38 48.21,78.98
  Bottom Layer w0.254: v1(50.13,79.38) 69.43,79.38 71.59,77.22
IO23: length 10.6
  Top Layer w0.254: H1.3 52.8,75.57 53.68,76.45 53.68,78.99 52.43,80.25 48.21,80.25
IO25: length 25.1
  Top Layer w0.254: v1(32.73,70.87) 31.96,70.09 30.21,70.09 ; v1(50.13,77.72) 51.65,77.72 H1.4
  Bottom Layer w0.254: v1(50.13,77.72) 39.59,77.72 v1(32.73,70.87)
IO26: length 7.7
  Top Layer w0.254: R11.1 24.47,65.52 27.76,68.82 30.21,68.82
IO27: length 21.1
  Top Layer w0.254: KEY1.1 23.45,50.35 R2.2 23.45,56.63 26.13,59.31 26.13,65.28 28.4,67.55 30.21,67.55
IO32: length 121.2
  Top Layer w0.254: R5.2 97.65,27.95 ; 97.65,27.95 99.16,27.95 100.29,29.08 109.69,29.08 117.4,21.38 KEY4.1 ; 97.65,27.95 97.75,28.05 v1(97.75,32.77) ; v1(32.86,74.3) 32.86,74.17 31.19,72.51 U4.8 ; v1(34.76,74.17) 34.89,74.04 34.89,70.61 39.59,65.91 44.79,65.91 47.46,63.25 v1(48.1,63.25)
  Bottom Layer w0.254: v1(97.75,32.77) 92.29,38.23 73.12,38.23 v1(48.1,63.25) ; v1(34.76,74.17) 34.39,74.54 33.1,74.54 v1(32.86,74.3)
IO33: length 81.7
  Top Layer w0.254: Reset.2 97.78,67.56 R10.1 80.09,82.17 v1(55.72,82.17) ; v1(32.09,72.01) 31.45,71.36 30.21,71.36
  Bottom Layer w0.254: v1(55.72,82.17) 54.45,82.17 52.41,80.14 34.89,80.14 32.09,77.34 v1(32.09,72.01)
IO34: length 14.5
  Top Layer w0.254: 30.21,75.17 18.69,75.17 H2.2
IO35: length 15.4
  Top Layer w0.254: H2.1 16.49,73.9 30.21,73.9
RTS: length 21.4
  Top Layer w0.254: v1(52.41,39.37) 52.41,34.04 50.64,32.26 U3.14 47.08,32.26 46.33,31.51 Q3.2
  Bottom Layer w0.254: 52.54,44.45 52.41,44.32 v1(52.41,39.37)
RXDO: length 137
  Top Layer w0.254: v1(56.99,31.37) 56.61,30.99 U3.2 ; 48.21,76.44 48.09,76.33 46.57,76.33 43.33,73.09 v1(42.83,73.09)
  Bottom Layer w0.254: 15.71,68.12 8.6,61 8.6,53.21 15.2,46.61 28.41,46.61 29.81,45.21 29.81,25.53 33.36,21.97 37.17,21.97 45.56,30.35 55.97,30.35 v1(56.99,31.37) ; 15.71,68.12 H3.2 ; 15.71,68.12 37.22,68.12 42.19,73.09 v1(42.83,73.09)
SENSOR_VN: length 13.6
  Top Layer w0.254: 17.87,79.46 20.89,76.44 30.21,76.44
SENSOR_VP: length 12.7
  Top Layer w0.254: H2.4 23.09,77.71 30.21,77.71
TXDO: length 94.8
  Top Layer w0.254: v1(57.24,32.64) 56.86,32.26 U3.3 ; 48.21,77.71 45.93,77.71 v1(45.05,76.84) ; v1(25.74,69.22) 24.73,70.23 17.87,70.23 13.55,65.92 H3.1
  Bottom Layer w0.254: 43.99,75.78 43.36,75.78 36.79,69.22 v1(25.74,69.22) ; 43.99,75.78 v1(45.05,76.84) ; 43.99,75.78 43.99,45.89 v1(57.24,32.64)
$1N4177: length 5
  Top Layer w0.254: LED1.1 37.93,45.47 R6.2
$1N4181: length 17.2
  Top Layer w0.254: LED1.2 32.73,42.16 22.76,42.16 KEY1.4
$1N4249: length 5.4
  Top Layer w0.254: LED2.1 27.4,26.54 30.44,26.54 R7.2
$1N4314: length 7.2
  Top Layer w0.254: R8.2 101.06,38.35 101.69,38.99 101.69,42.16 100.8,43.05 LED3.1
$1N4446: length 5.8
  Top Layer w0.254: R9.2 99.67,21.47 LED4.1
$1N4453: length 7
  Top Layer w0.254: 101.69,26.03 108.18,26.03 KEY4.4
$1N4457: length 6.7
  Top Layer w0.254: LED3.2 101.31,47.24 103.66,47.24 KEY3.4
$1N4462: length 20.5
  Top Layer w0.254: KEY2.4 12.45,17.74 14.19,16 22.7,16 26.76,20.07 LED2.2
$1N4873: length 2.1
  Top Layer w0.254: Q1.1 23.64,63.82 R11.2
$1N4989: length 8.3
  Top Layer w0.254: BUZZER1.2 18.22,64.76 D1.1 Q1.3
$1N17958: length 6.6
  Top Layer w0.254: Q3.1 43.23,28.96 R13.2
$1N17984: length 6.9
  Top Layer w0.254: R14.2 42.38,38.99 42.89,38.48 42.82,38.42 Q2.1

## Copper pours and planes (outline as drawn; the poured copper is in the pictures)
GND on Top Layer: -3.34,100.97 131.92,100.97 131.92,-3.94 -3.34,-3.94
GND on Bottom Layer: -2.7,100.46 133.82,100.46 133.82,-4.19 -2.7,-4.19
(no net) on Top Layer: 28.79,89.54 48.86,89.54 48.86,83.19 28.79,83.19
(no net) on Bottom Layer: 28.92,89.54 48.86,89.54 48.86,83.06 28.92,83.06

## Text on the board
Bottom Silkscreen Layer: - | + | Battery
Top Silkscreen Layer: IO25 | IO23 | IO15 | IO16 | SENSOR_VN | SENSOR_VP | RXDO | GND | 3V3 | IO35 | IO34 | 5V | D- | D+ | TXDO
